# EAGLE design half-pint-turbidimeter_led_wires (EAGLE 7.3.0)
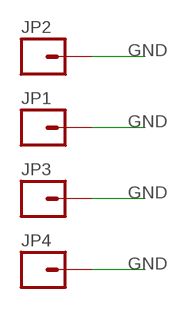
[diagram p0: schematic, sheet 1]

## Parts
JP1  M01PTH  [1X01]
JP2  M01PTH  [1X01]
JP3  M01PTH  [1X01]
JP4  M01PTH  [1X01]

## Nets
GND: JP1.1 JP2.1 JP3.1 JP4.1

## Library data of the parts
JP1-JP4 = SparkFun-Connectors:M01: Header 1 Standard 1-pin 0.1" header. Use with straight break away headers (SKU : PRT-00116), right angle break away headers (PRT-00553), swiss pins (PRT-00743), machine pins (PRT-00117), and female headers (PRT-00115).

## Board
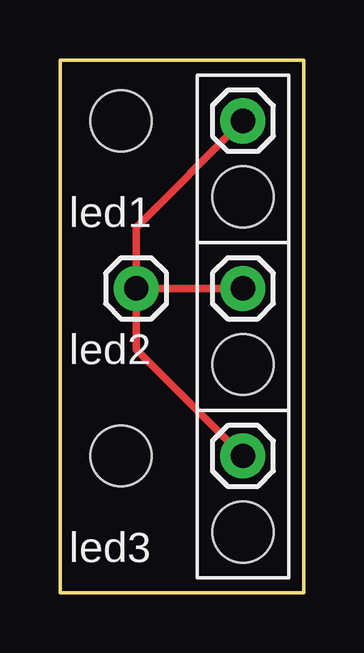
[diagram p1: board, top side]
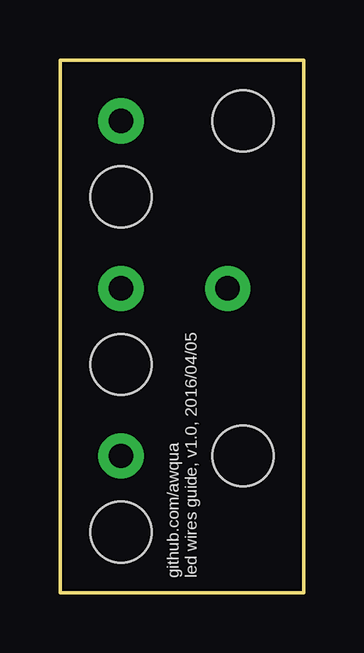
[diagram p2: board, bottom side, seen from below]

Size 10.16 x 22.23 mm. Coordinates in mm from the lower left corner, seen from the top.
Outline: 0,0 10.16,0 10.16,22.23 0,22.23 0,0
Copper layers (1*16): Top 0.035mm / dielectric 1.5mm / Bottom 0.035mm
Design rules "default": minimum track width 10mil, minimum drill 24mil, track to track 8mil, track to pad 8mil, pad to pad 8mil, via to via 8mil, smd to smd 8mil, copper to edge 40mil, drill to drill 8mil, minimum pad ring 10mil, minimum via ring 8mil, stop-mask expansion 4mil, vias tented up to drill 0mil, thermal gap 10mil
Holes 2.54 mm at 2.54,19.68 7.62,16.51 7.62,9.53 7.62,2.54 2.54,5.71

### Footprints (pad centres in the part's own frame; a part is rotated, then mirrored left to right if it is on the bottom)
1X01 = drill 1.016 pad 1.88: 1 0,0

### Placement (x,y rotation side)
JP1  7.62,12.7 0 top
JP2  7.62,19.68 0 top
JP3  7.62,5.71 0 top
JP4  3.17,12.7 0 top

### Tracks (layer width: path | path; a pad name or v marks a point on that pad's centre or on a via)
GND
  Top 0.305: JP2.1 3.17,15.24 JP4.1 | JP4.1 JP1.1 | JP3.1 3.17,10.16 JP4.1

### Text on the board
tPlace: led1 | led2 | led3
bPlace: github.com/awqua / led wires guide, v1.0, 2016/04/05